# EAGLE design V4-AddRS485-V01-017 (EAGLE 9.1.1)
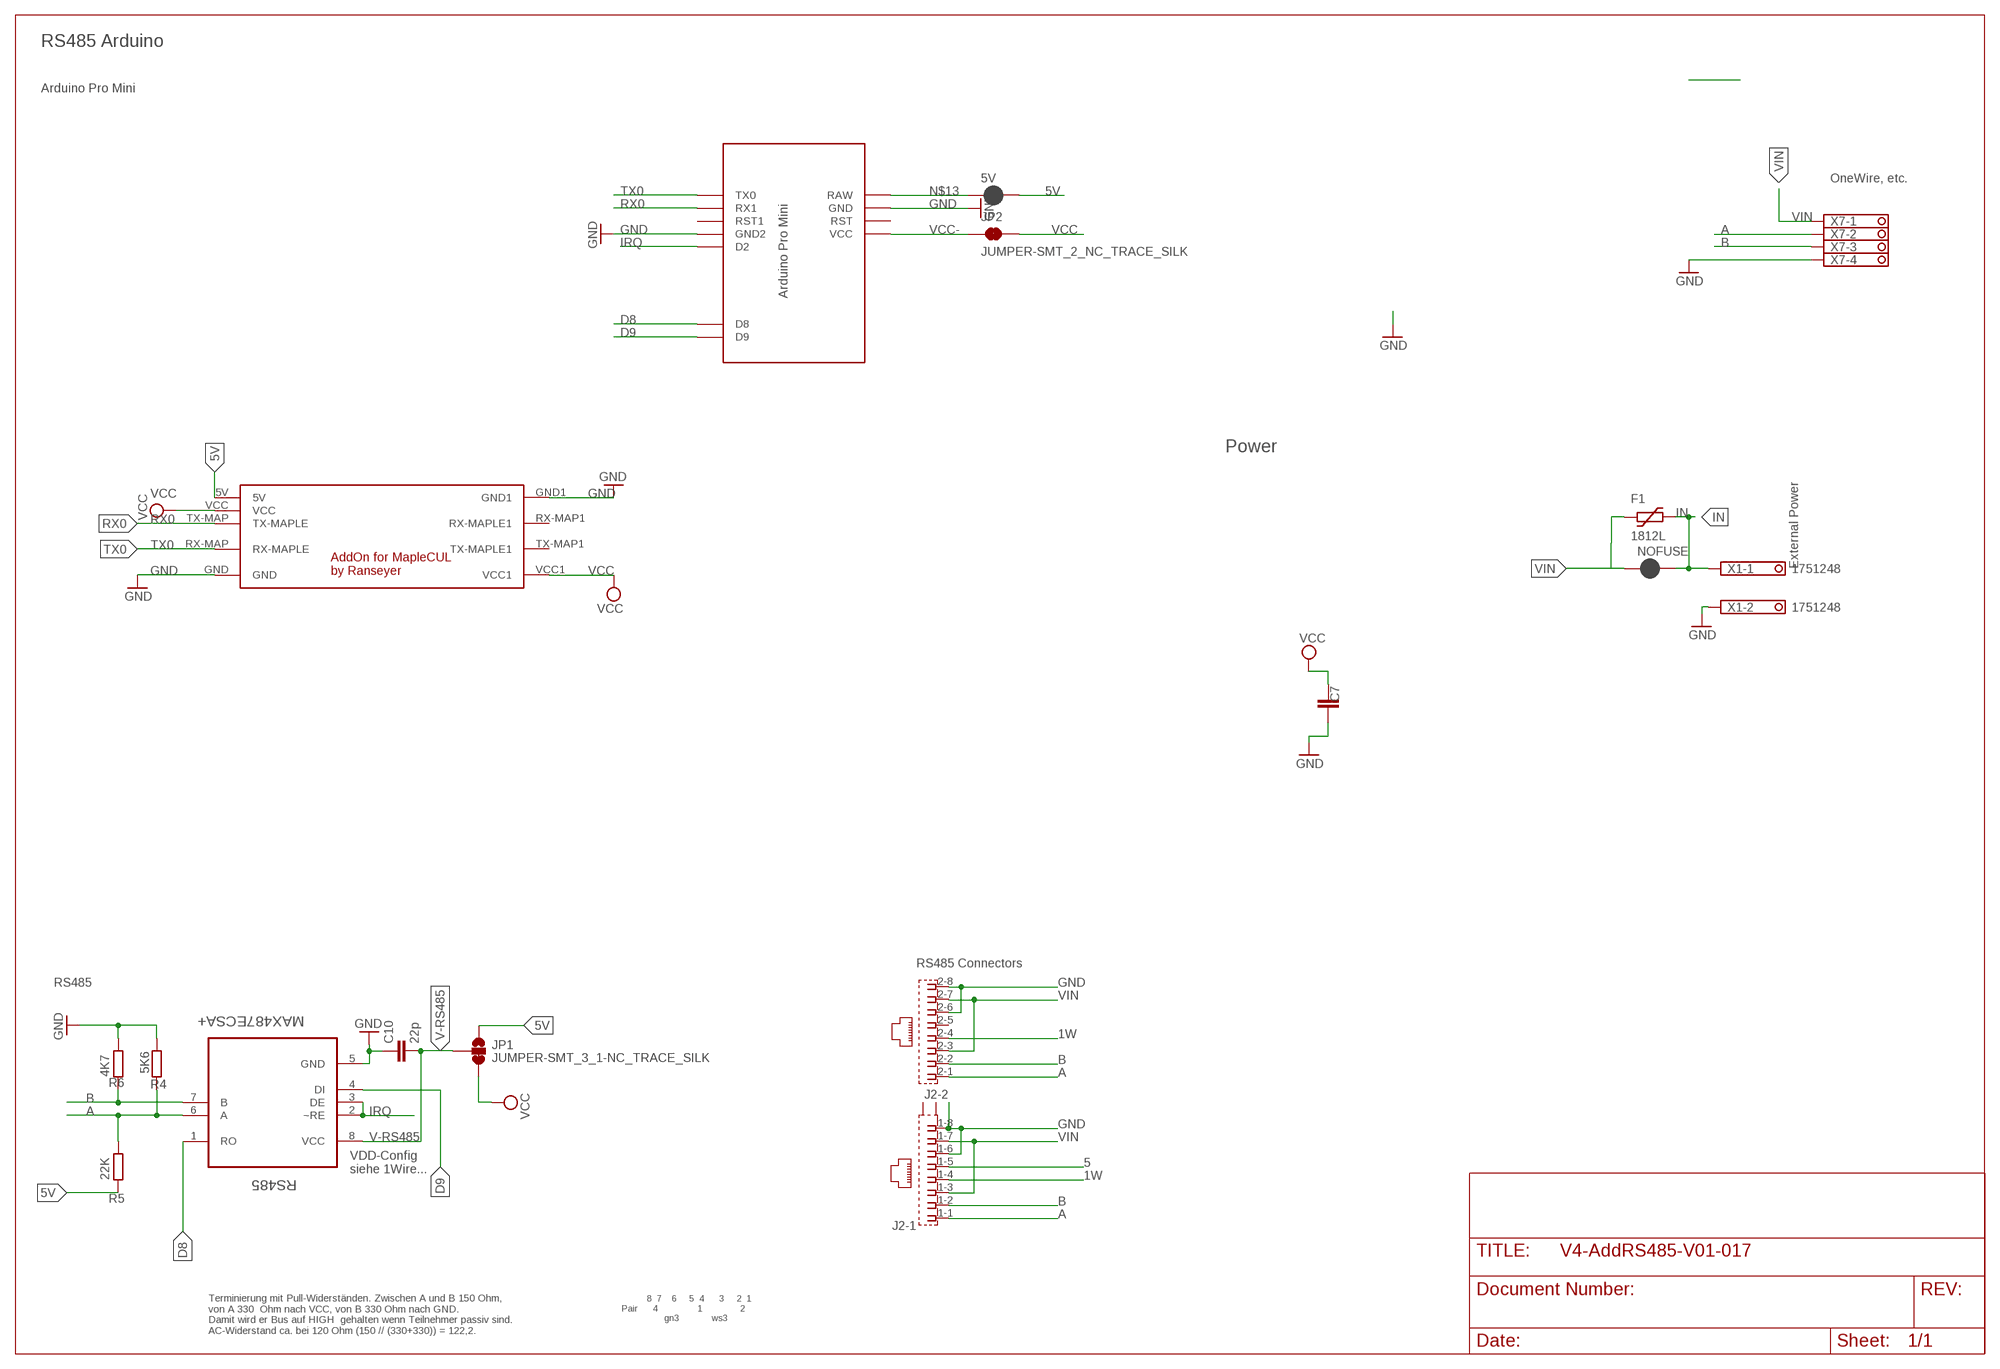
[diagram p0: schematic, sheet 1]

## Parts
5V  JUMPER-SMT_2_NC_PASTE_NO-SILK  [SMT-JUMPER_2_NC_PASTE_NO-SILK]
C7  C-EUC1812  [C1812]
C10  22p  C-EUC0805  [C0805]
F1  1812L  [1812L]
J2  RJ45_2X_S  [RJ45_2X_S]
JP1  JUMPER-SMT_3_1-NC_TRACE_SILK  [SMT-JUMPER_3_1-NC_TRACE_SILK]
JP2  JUMPER-SMT_2_NC_TRACE_SILK  [SMT-JUMPER_2_NC_TRACE_SILK]
NOFUSE  JUMPER-SMT_2_NC_PASTE_NO-SILK  [SMT-JUMPER_2_NC_PASTE_NO-SILK]
R4  5K6  R-EU_R0805  [R0805]
R5  22K  R-EU_R0805  [R0805]
R6  4K7  R-EU_R0805  [R0805]
RS485  MAX487ECSA+  [SOIC127P600X175-8N]
U$2  MAPLE-CUL-ADDON-V01  [MAPLE-CUL-V01]
U$3  MARTIN-PRO-MINI-RS485  [MARTIN-PRO-MINI-RS485]
X1  1751248  [1751248]
X7  1751264  [1751264]

## Nets
1W: J2.1-4 J2.2-4
5: J2.1-5
5V: 5V.2 JP1.1 R5.1 U$2.5V
A: J2.1-1 J2.2-1 R4.2 R5.2 RS485.6(A) X7.2
B: J2.1-2 J2.2-2 R6.1 RS485.7(B) X7.3
D8: RS485.1(RO) U$3.D8
D9: RS485.4(DI) U$3.D9
GND [PWR]: C7.1 C10.1 J2.1-6 J2.1-8 J2.2-6 J2.2-8 R4.1 R6.2 RS485.5(GND) U$2.GND U$2.GND1 U$3.GND U$3.GND1(GND2) X1.2 X7.4
IN [PWR]: F1.P$2 NOFUSE.2 X1.1
IRQ: RS485.2(~RE) RS485.3(DE) U$3.D2
N$13: 5V.1 U$3.RAW
RX0: U$2.TX-MAP(TX-MAPLE) U$3.RX1
TX0: U$2.RX-MAP(RX-MAPLE) U$3.TX0
V-RS485 [PWR]: C10.2 JP1.2 RS485.8(VCC)
VCC [PWR]: C7.2 JP1.3 JP2.2 U$2.VCC U$2.VCC1
VCC- [PWR]: JP2.1 U$3.VCC
VIN [PWR]: F1.P$1 J2.1-3 J2.1-7 J2.2-3 J2.2-7 NOFUSE.1 X7.1
Unconnected: J2.2-5 J2.G1(-1:S2) J2.G3(-1:S1) U$2.RX-MAP1(RX-MAPLE1) U$2.TX-MAP1(TX-MAPLE1) U$3.RST U$3.RST1

## Notes on the sheet
- RS485 Arduino
- Arduino Pro Mini
- OneWire, etc.
- Power
- External Power
- RS485 Connectors
- RS485
- VDD-Config
  siehe 1Wire...
- 8  7    6     5  4      3     2  1
  Pair      4                1               2
                   gn3             ws3
- Terminierung mit Pull-Widerständen. Zwischen A und B 150 Ohm,
  von A 330  Ohm nach VCC, von B 330 Ohm nach GND. 
  Damit wird er Bus auf HIGH  gehalten wenn Teilnehmer passiv sind.
  AC-Widerstand ca. bei 120 Ohm (150 // (330+330)) = 122,2.

## Library data of the parts
5V NOFUSE = SparkFun-Jumpers:JUMPER-SMT_2_NC_PASTE: Normally closed solder jumper This jumper has an aperture in the stencil to allow solder paste to bridge the split in the wire so it's normally closed (NC). Wick off the solder to open the connection. Reapply solder to reclose the connection.
C7 = rcl:C-EU: CAPACITOR, European symbol; SPICEPREFIX: C
C10 = rcl:C-EU: CAPACITOR, European symbol
F1 = ptc-littlefuse:1812L
J2 = RJ45:RJ45_2X_S: AMP connector
JP1 = SparkFun-Jumpers:JUMPER-SMT_3_1-NC_TRACE: Normally closed trace jumper (1 of 2 connections) This jumper has a trace between two pads so it's normally closed (NC). The other connection is normally open (NO). Use a razor knife to open the connection. For best results follow the IPC guidelines for cutting traces: Cutout at least 0.063 mm (0.005 in). Remove all loose material to clean up the cut area. Seal the cut with an approved epoxy. Reapply solder to reclose the connection, or to close the NO connection.
JP2 = SparkFun-Jumpers:JUMPER-SMT_2_NC_TRACE: Normally closed trace jumper This jumper has a trace between two pads so it's normally closed (NC). Use a razor knife to open the connection. For best results follow the IPC guidelines for cutting traces: Cutout at least 0.063 mm (0.005 in). Remove all loose material to clean up the cut area. Seal the cut with an approved epoxy. Reapply solder to reclose the connection.
R4-R6 = rcl:R-EU_: RESISTOR, European symbol
RS485 = Maxim_By_element14_Batch_1:MAX487ECSA+: Low-Power, Slew-Rate-Limited RS-485/RS-422 Transceivers; MPN: MAX487ECSA+; OC_FARNELL: 9724532; OC_NEWARK: 68K4803; PACKAGE: SOIC-8; SUPPLIER: Maxim
U$2 = Martin-Communication-V4:MAPLE-CUL-ADDON-V01: AddOn for MAPLE-CUL V4.x
U$3 = Arduino-clone:MARTIN-PRO-MINI-RS485: ABK Pro-Mini Arduino Clone
X1 = con-phoenix-350:1751248: MKDS 1/ 2-3,5 Printklemme Nennstrom: 10 A Bemessungsspannung: 160 V Raster: 3,5 mm Polzahl: 2 Montageart: Löten Anschlussart: Schraubanschluss Anschlussrichtung vom Leiter zur Platine: 0° Source: http://eshop.phoenixcontact.com .. 1751248.pdf; OC_FARNELL: unknown; OC_NEWARK: unknown
X7 = con-phoenix-350:1751264: MKDS 1/ 4-3,5 Printklemme Nennstrom: 10 A Bemessungsspannung: 160 V Raster: 3,5 mm Polzahl: 4 Montageart: Löten Anschlussart: Schraubanschluss Anschlussrichtung vom Leiter zur Platine: 0° Source: http://eshop.phoenixcontact.com .. 1751264.pdf; MPN: 1751264; OC_FARNELL: unknown; OC_NEWARK: 10R0934

## Net classes
0 default: width 0.305 mm, drill 0.076 mm, clearance 0.051 mm
1 PWR: width 0.406 mm, drill 0.076 mm, clearance 0.051 mm

## Board
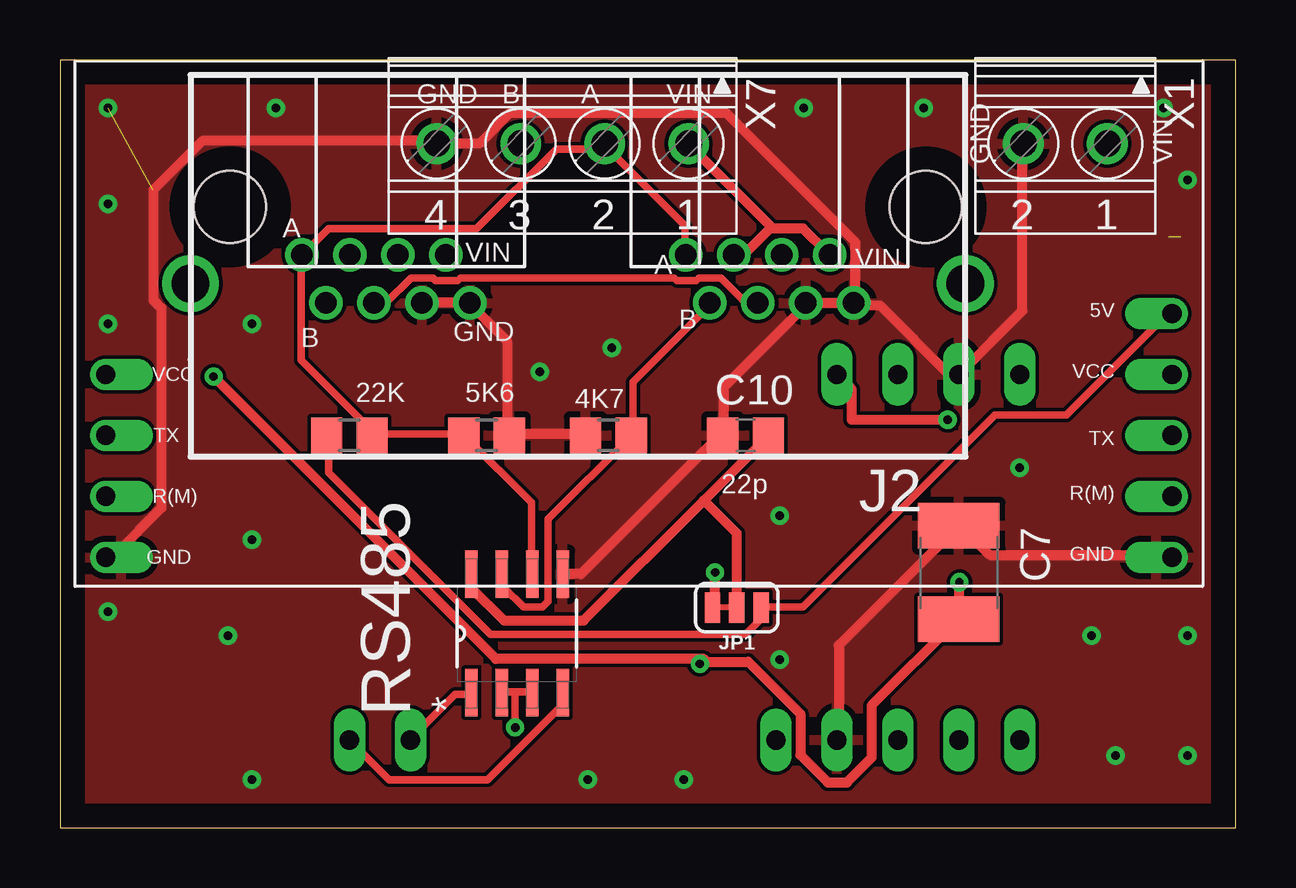
[diagram p1: board, top side]
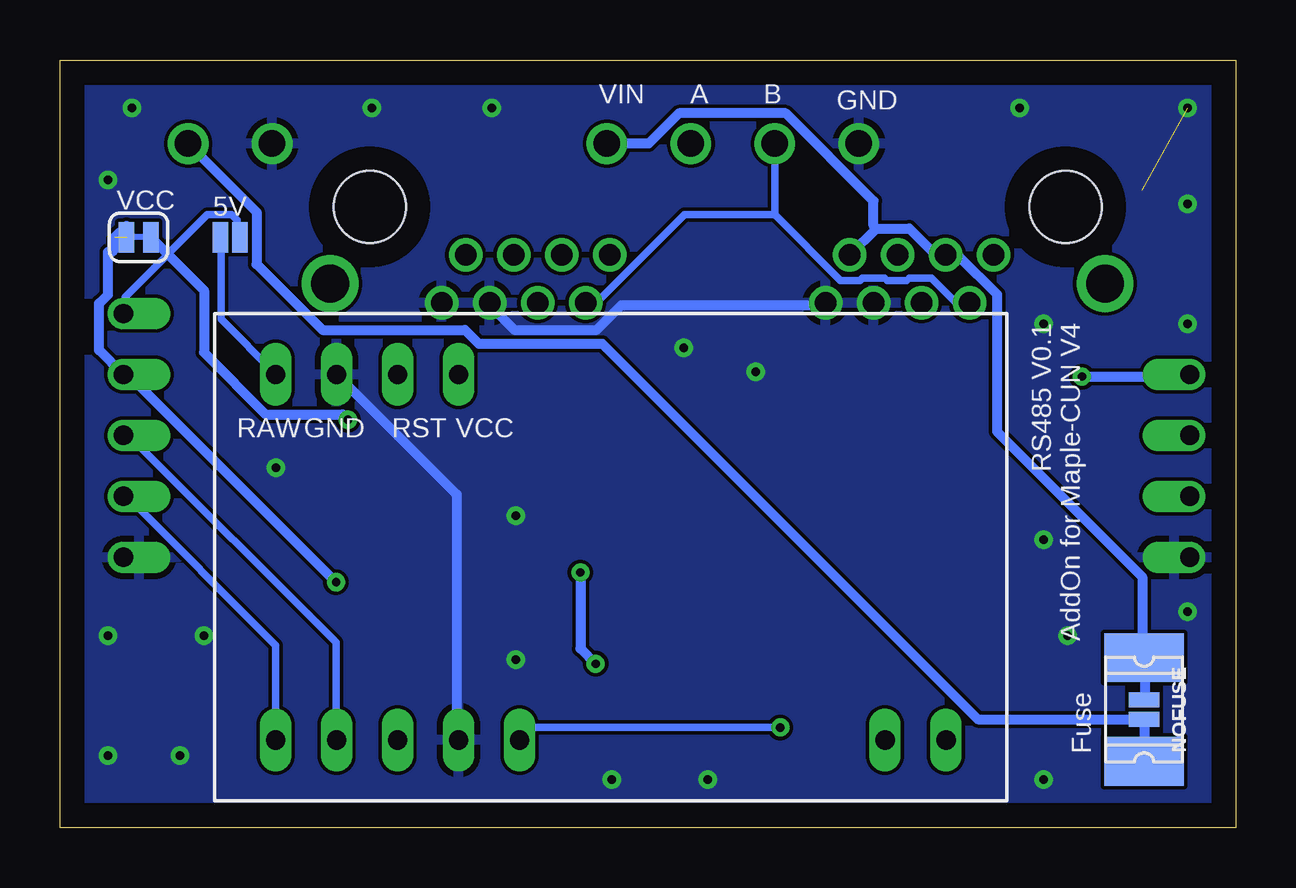
[diagram p2: board, bottom side, seen from below]

Size 49 x 32 mm. Coordinates in mm from the lower left corner, seen from the top.
Outline: 0,0 49,0 49,32 0,32 0,0
Copper layers (1*16): Top 0.035mm / dielectric 1.5mm / Bottom 0.035mm
Design rules "default": minimum track width 6mil, minimum drill 0.35mm, track to track 6mil, track to pad 6mil, pad to pad 6mil, via to via 6mil, smd to smd 6mil, copper to edge 40mil, drill to drill 6mil, minimum pad ring 10mil, minimum via ring 8mil, stop-mask expansion 4mil, vias tented up to drill 0mil, thermal gap 10mil

### Footprints (pad centres in the part's own frame; a part is rotated, then mirrored left to right if it is on the bottom)
SMT-JUMPER_2_NC_PASTE_NO-SILK = smd 0.635 x 1.27: 1 -0.406,0; 2 0.406,0
C1812 = smd 1.9 x 3.4: 1 -1.95,0; 2 1.95,0
C0805 = smd 1.3 x 1.5: 1 -0.95,0; 2 0.95,0
1812L = smd 2.03 x 3.3: P$1 -2.16,0; P$2 2.16,0
RJ45_2X_S = drill 0.889: 1-1 -4.5,2; 1-2 -5.5,4; 1-3 -6.5,2; 1-4 -7.5,4; 1-5 -8.5,2; 1-6 -9.5,4; 1-7 -10.5,2; 1-8 -11.5,4; 2-1 11.5,2; 2-2 10.5,4; 2-3 9.5,2; 2-4 8.5,4; 2-5 7.5,2; 2-6 6.5,4; 2-7 5.5,2; 2-8 4.5,4 | drill 1.575 pad 2.184: G1 -16.15,3.2; G3 16.15,3.2 | hole 3: -14.5,0; 14.5,0
SMT-JUMPER_3_1-NC_TRACE_SILK = smd 0.635 x 1.27: 1 -1.016,0; 2 0,0; 3 1.016,0
SMT-JUMPER_2_NC_TRACE_SILK = smd 0.635 x 1.27: 1 -0.508,0; 2 0.508,0
R0805 = smd 1.3 x 1.5: 1 -0.95,0; 2 0.95,0
SOIC127P600X175-8N = smd 1.981 x 0.533: 1 -2.464,1.905; 2 -2.464,0.635; 3 -2.464,-0.635; 4 -2.464,-1.905; 5 2.464,-1.905; 6 2.464,-0.635; 7 2.464,0.635; 8 2.464,1.905
MAPLE-CUL-V01 = drill 0.8 offset: 5V 1.27,2.54; GND 1.27,12.7; GND1 45.72,12.7; RX-MAP 1.27,10.16; RX-MAP1 45.72,10.16; TX-MAP 1.27,7.62; TX-MAP1 45.72,7.62; VCC 1.27,5.08; VCC1 45.72,5.08
MARTIN-PRO-MINI-RS485 = drill 0.8 long: D2 -5.08,-3.81; D8 -5.08,-19.05; D9 -5.08,-21.59; GND 10.16,3.81; GND1 -5.08,-1.27; RAW 10.16,6.35; RST 10.16,1.27; RST1 -5.08,1.27; RX1 -5.08,3.81; TX0 -5.08,6.35; VCC 10.16,-1.27
1751248 = drill 1.1 pad 1.7: 1 -1.75,-0.1; 2 1.75,-0.1
1751264 = drill 1.1 pad 1.7: 1 -5.25,-0.1; 2 -1.75,-0.1; 3 1.75,-0.1; 4 5.25,-0.1

### Placement (x,y rotation side)
5V  41.91,24.61 0 bottom
C7  37.47,10.63 270 top
C10  28.57,16.35 0 top
F1  3.81,4.92 270 bottom
J2  21.59,25.88 180 top
JP1  28.21,9.17 180 top
JP2  45.72,24.61 180 bottom
NOFUSE  3.81,4.92 270 bottom
R4  17.78,16.35 180 top
R5  12.06,16.35 0 top
R6  22.86,16.35 180 top
RS485  19.05,8.1 90 top
U$2  47.62,23.97 180 top
U$3  33.66,8.73 90 bottom
X1  41.91,28.41 180 top
X7  20.95,28.41 180 top

### Tracks (layer width: path | path; a pad name or v marks a point on that pad's centre or on a via)
1W
  Top 0.305: J2.2-4 13.14,21.89 13.6,21.89 14.63,22.92 15.54,22.92 15.66,22.8 16.57,22.8 16.69,22.92 25.6,22.92 25.72,22.8 26.52,22.8 26.63,22.92 27.55,22.92 28.57,21.89 29.03,21.89 J2.1-4
5V
  Top 0.305: U$2.5V 46.29,21.43 46.18,21.43 41.95,17.2 38.98,17.2 30.98,9.2 29.26,9.2 JP1.1 29.15,9.09 29.15,8.63 28.57,8.06 17.95,8.06 11.2,14.8 11.2,16.29 R5.1
  Bottom 0.305: 5V.2 41.6,24.63 41.6,25.32 41.83,25.55 42.86,25.55 46.29,22.12 46.29,21.43 U$2.5V
A
  Top 0.305: J2.1-1 26.06,23.95 26.06,25.09 22.75,28.4 X7.2 22.63,28.29 20.69,28.29 17.37,24.97 11.2,24.97 10.17,23.95 J2.2-1 10.06,23.83 10.06,19.49 13.03,16.52 R5.2 13.03,16.4 16.8,16.4 R4.2 16.92,16.29 19.66,13.54 19.66,10.57 RS485.6
B
  Top 0.305: J2.1-2 27.09,21.77 23.89,18.57 23.89,16.4 R6.1 23.77,16.29 20.34,12.86 20.34,9.43 20.12,9.2 19.32,9.2 18.52,10 18.52,10.46 RS485.7
  Bottom 0.305: 19.2,25.55 16.46,22.8 15.66,22.8 15.54,22.92 14.63,22.92 14.52,22.8 13.72,22.8 13.6,22.92 12.69,22.92 11.66,21.89 11.2,21.89 J2.2-2 | 19.2,25.55 19.2,28.4 X7.3 | 19.2,25.55 19.32,25.55 22.97,25.55 26.63,21.89 J2.1-2
D8
  Top 0.305: RS485.1 17.14,5.54 16.46,5.54 14.63,3.71 U$3.D8
D9
  Top 0.305: RS485.4 20.92,5.54 20.92,5.08 17.83,2 13.72,2 12.12,3.6 U$3.D9
GND  (via drill 0.35)  (1 unrouted)
  Top 0.406: U$2.GND1 1.94,11.37 2.29,11.37 4.23,13.31 4.23,21.66 3.89,22 3.89,26.57 5.94,28.63 15.54,28.63 15.66,28.52 X7.4 15.89,28.52 17.49,28.52 18.75,29.77 27.77,29.77 33.15,24.4 33.15,22 J2.1-8 | U$3.GND1 32.46,3.71 32.46,7.6 37.38,12.52 C7.1 37.6,12.52 38.75,11.37 46.29,11.37 U$2.GND | J2.1-8 33.15,21.77 34.18,21.77 37.03,18.91 37.38,18.91 U$3.GND 37.6,19.03 40.12,21.54 40.12,28.4 X1.2 | R6.2 21.83,16.4 18.75,16.4 R4.1 18.63,16.52 18.63,20.29 17.14,21.77 J2.2-8 16.92,21.89 15.2,21.89 J2.2-6 | RS485.5 21.03,10.57 21.72,10.57 27.43,16.29 C10.1 27.66,16.4 27.66,18.34 31.09,21.77 J2.1-6 31.2,21.89 32.92,21.89 J2.1-8
  Bottom 0.406: J2.2-8 17.14,21.77 25.6,21.77 26.63,20.74 30.06,20.74 31.09,21.77 J2.1-6 | U$3.GND1 32.46,3.71 32.46,13.89 37.38,18.8 U$3.GND
  other vias: 2,30 2,26 8,21 9,30 7,8 8,12 20,19 23,20 31,30 36,30 46,30 47,27 47,8 47,3 44,3 43,8 40,15 30,13 30,7 26,2 22,2 8,2 2,9 2,21
  pour Top: 1,1 1,31 48,31 48,1
  pour Bottom: 1,31 48,31 48,1 1,1
IN
  Bottom 0.406: F1.P$2 3.77,2.8 3.77,4.51 NOFUSE.2 4,4.51 10.74,4.51 26.4,20.17 31.55,20.17 32.12,20.74 38.06,20.74 40.8,23.49 40.8,25.66 43.55,28.4 X1.1
IRQ  (via drill 0.35)
  Top 0.305: 18.97,5.66 19.66,5.66 RS485.3 | 18.97,5.66 18.52,5.66 RS485.2 | v18.97,4.17 18.97,5.54 18.97,5.66
  Bottom 0.305: v18.97,4.17 29.38,4.17 29.83,3.71 U$3.D2
N$13
  Bottom 0.305: 5V.1 42.29,24.52 42.29,21.2 40.01,18.91 U$3.RAW
RX0
  Bottom 0.305: U$3.RX1 37.49,3.71 37.49,7.71 46.06,16.29 46.29,16.29 U$2.TX-MAP
TX0
  Bottom 0.305: U$3.TX0 40.01,3.71 40.01,7.6 46.29,13.89 U$2.RX-MAP
V-RS485
  Top 0.406: 26.84,13.64 21.83,8.63 18.52,8.63 17.14,10 17.14,10.46 RS485.8 | 26.84,13.64 29.49,16.29 C10.2 | JP1.2 28.21,12.27 26.84,13.64
VCC  (via drill 0.35)  (1 unrouted)
  Top 0.406: v6.4,18.8 18.17,7.03 26.75,7.03 | 26.86,7.03 26.75,7.03 | v37.49,10.23 37.49,8.86 C7.2 37.38,8.63 33.83,5.08 33.83,2.91 32.8,1.88 32.69,1.88 32,1.88 30.86,3.03 30.86,4.74 28.69,6.91 26.98,6.91 v26.67,6.83 26.75,6.91 26.75,7.03 | JP1.3 27.3,9.28 v27.3,10.63
  Bottom 0.406: v6.4,18.8 1.94,18.8 U$2.VCC1 | v37.49,10.23 46.06,18.8 46.29,18.8 U$2.VCC 47.37,19.9 47.37,21.85 47,22.21 47,24 46.83,24 46.71,24.12 46.71,24.61 46.23,25.09 | v27.3,10.63 27.3,7.46 v26.67,6.83
VCC-  (via drill 0.35)
  Top 0.406: v37,17 33,17 33,18.27 U$3.VCC
  Bottom 0.406: JP2.1 43,22.39 43,19.8 40.42,17.23 37.23,17.23 v37,17
VIN
  Top 0.406: 29.6,24.97 28.57,23.95 28.12,23.95 J2.1-3 | 29.6,24.97 30.98,24.97 32,23.95 J2.1-7 | X7.1 26.29,28.4 29.6,25.09 29.6,24.97
  Bottom 0.406: NOFUSE.1 3.77,5.43 3.77,7.03 F1.P$1 3.89,7.26 3.89,10.46 9.94,16.52 9.94,22.23 11.54,23.83 11.89,23.83 J2.2-3 12.12,23.95 12.57,23.95 13.6,24.97 14.97,24.97 | 14.97,24.97 16,23.95 J2.2-7 | X7.1 26.18,28.52 24.46,28.52 23.2,29.77 18.75,29.77 15.09,26.12 15.09,25.09 14.97,24.97

### Text on the board
tNames: GND | B | A | VIN | GND | VIN | A | VIN | A | VIN | B | B | GND | 22K | 5K6 | 4K7 | 22p
bNames: GND | B | A | VIN | 5V | VCC | RS485 V0.1 / AddOn for Maple-CUN V4 | VCC | RST | GND | RAW | Fuse